# EasyEDA Pro project ProPrj_MiniFoc_AT32F403A.epro, schematic FOC_AT32_FD6288_CAN

## Sheets
1 电源
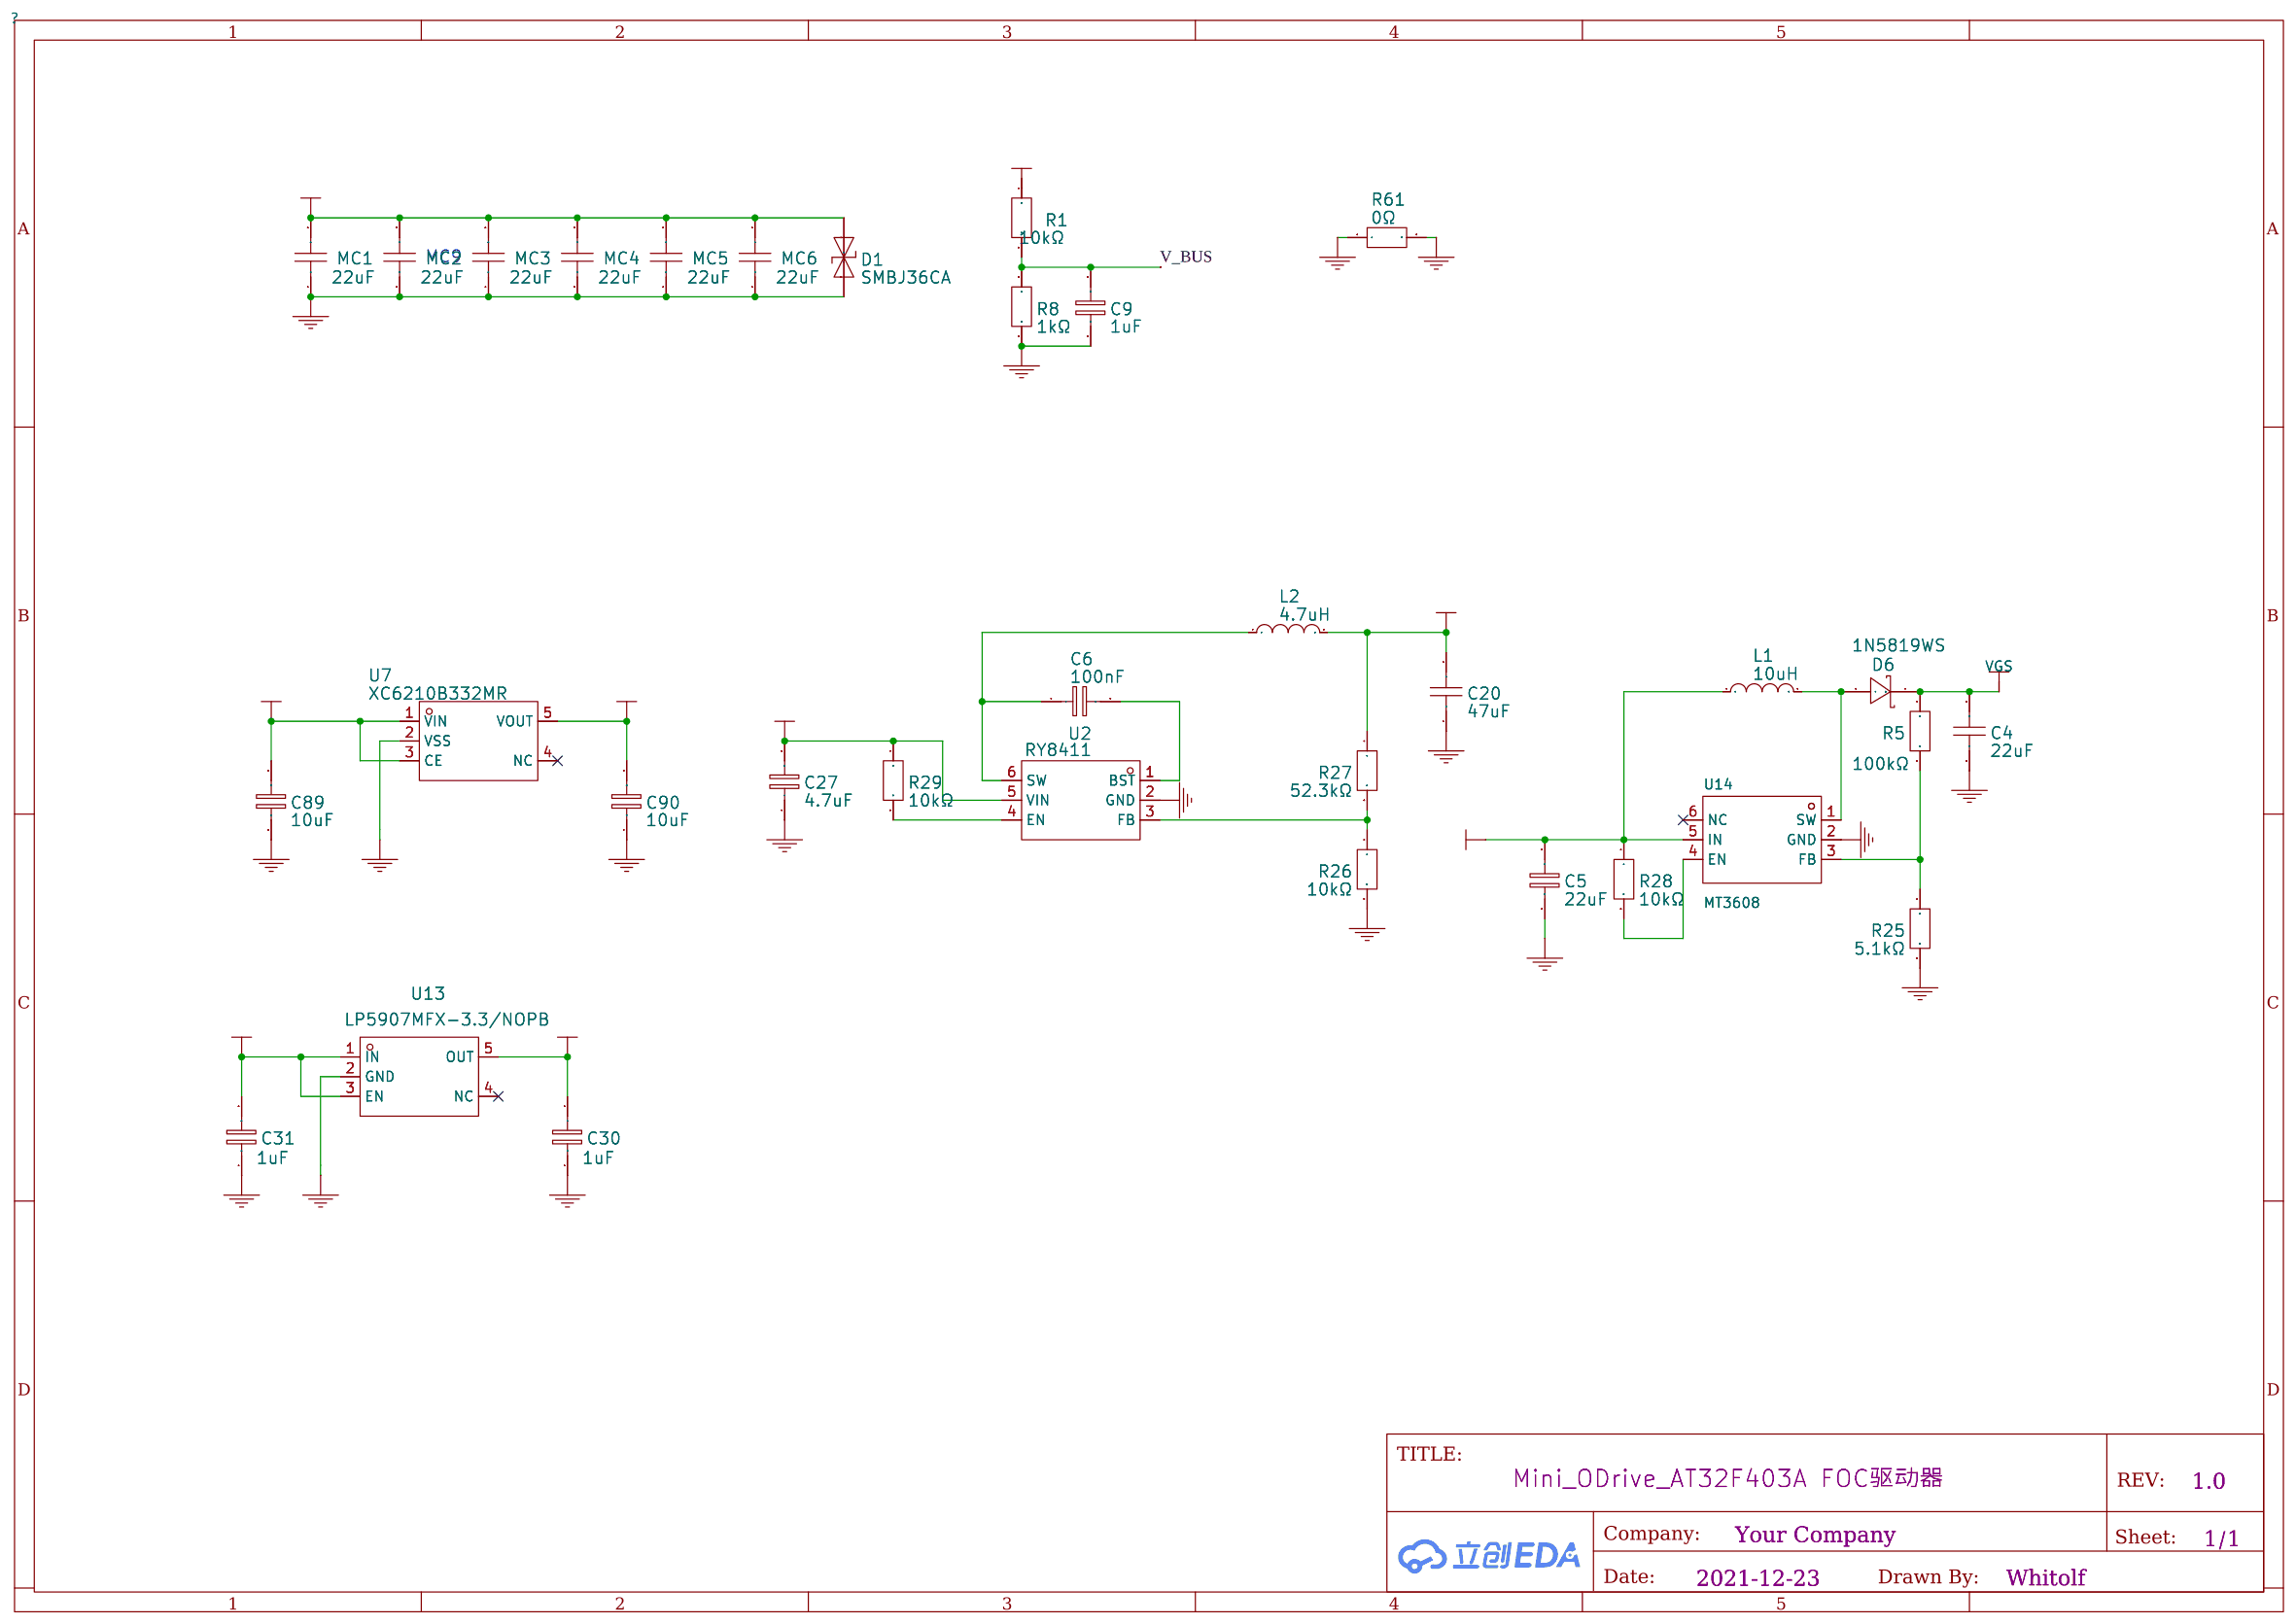
[diagram p0: 电源]
2 驱动
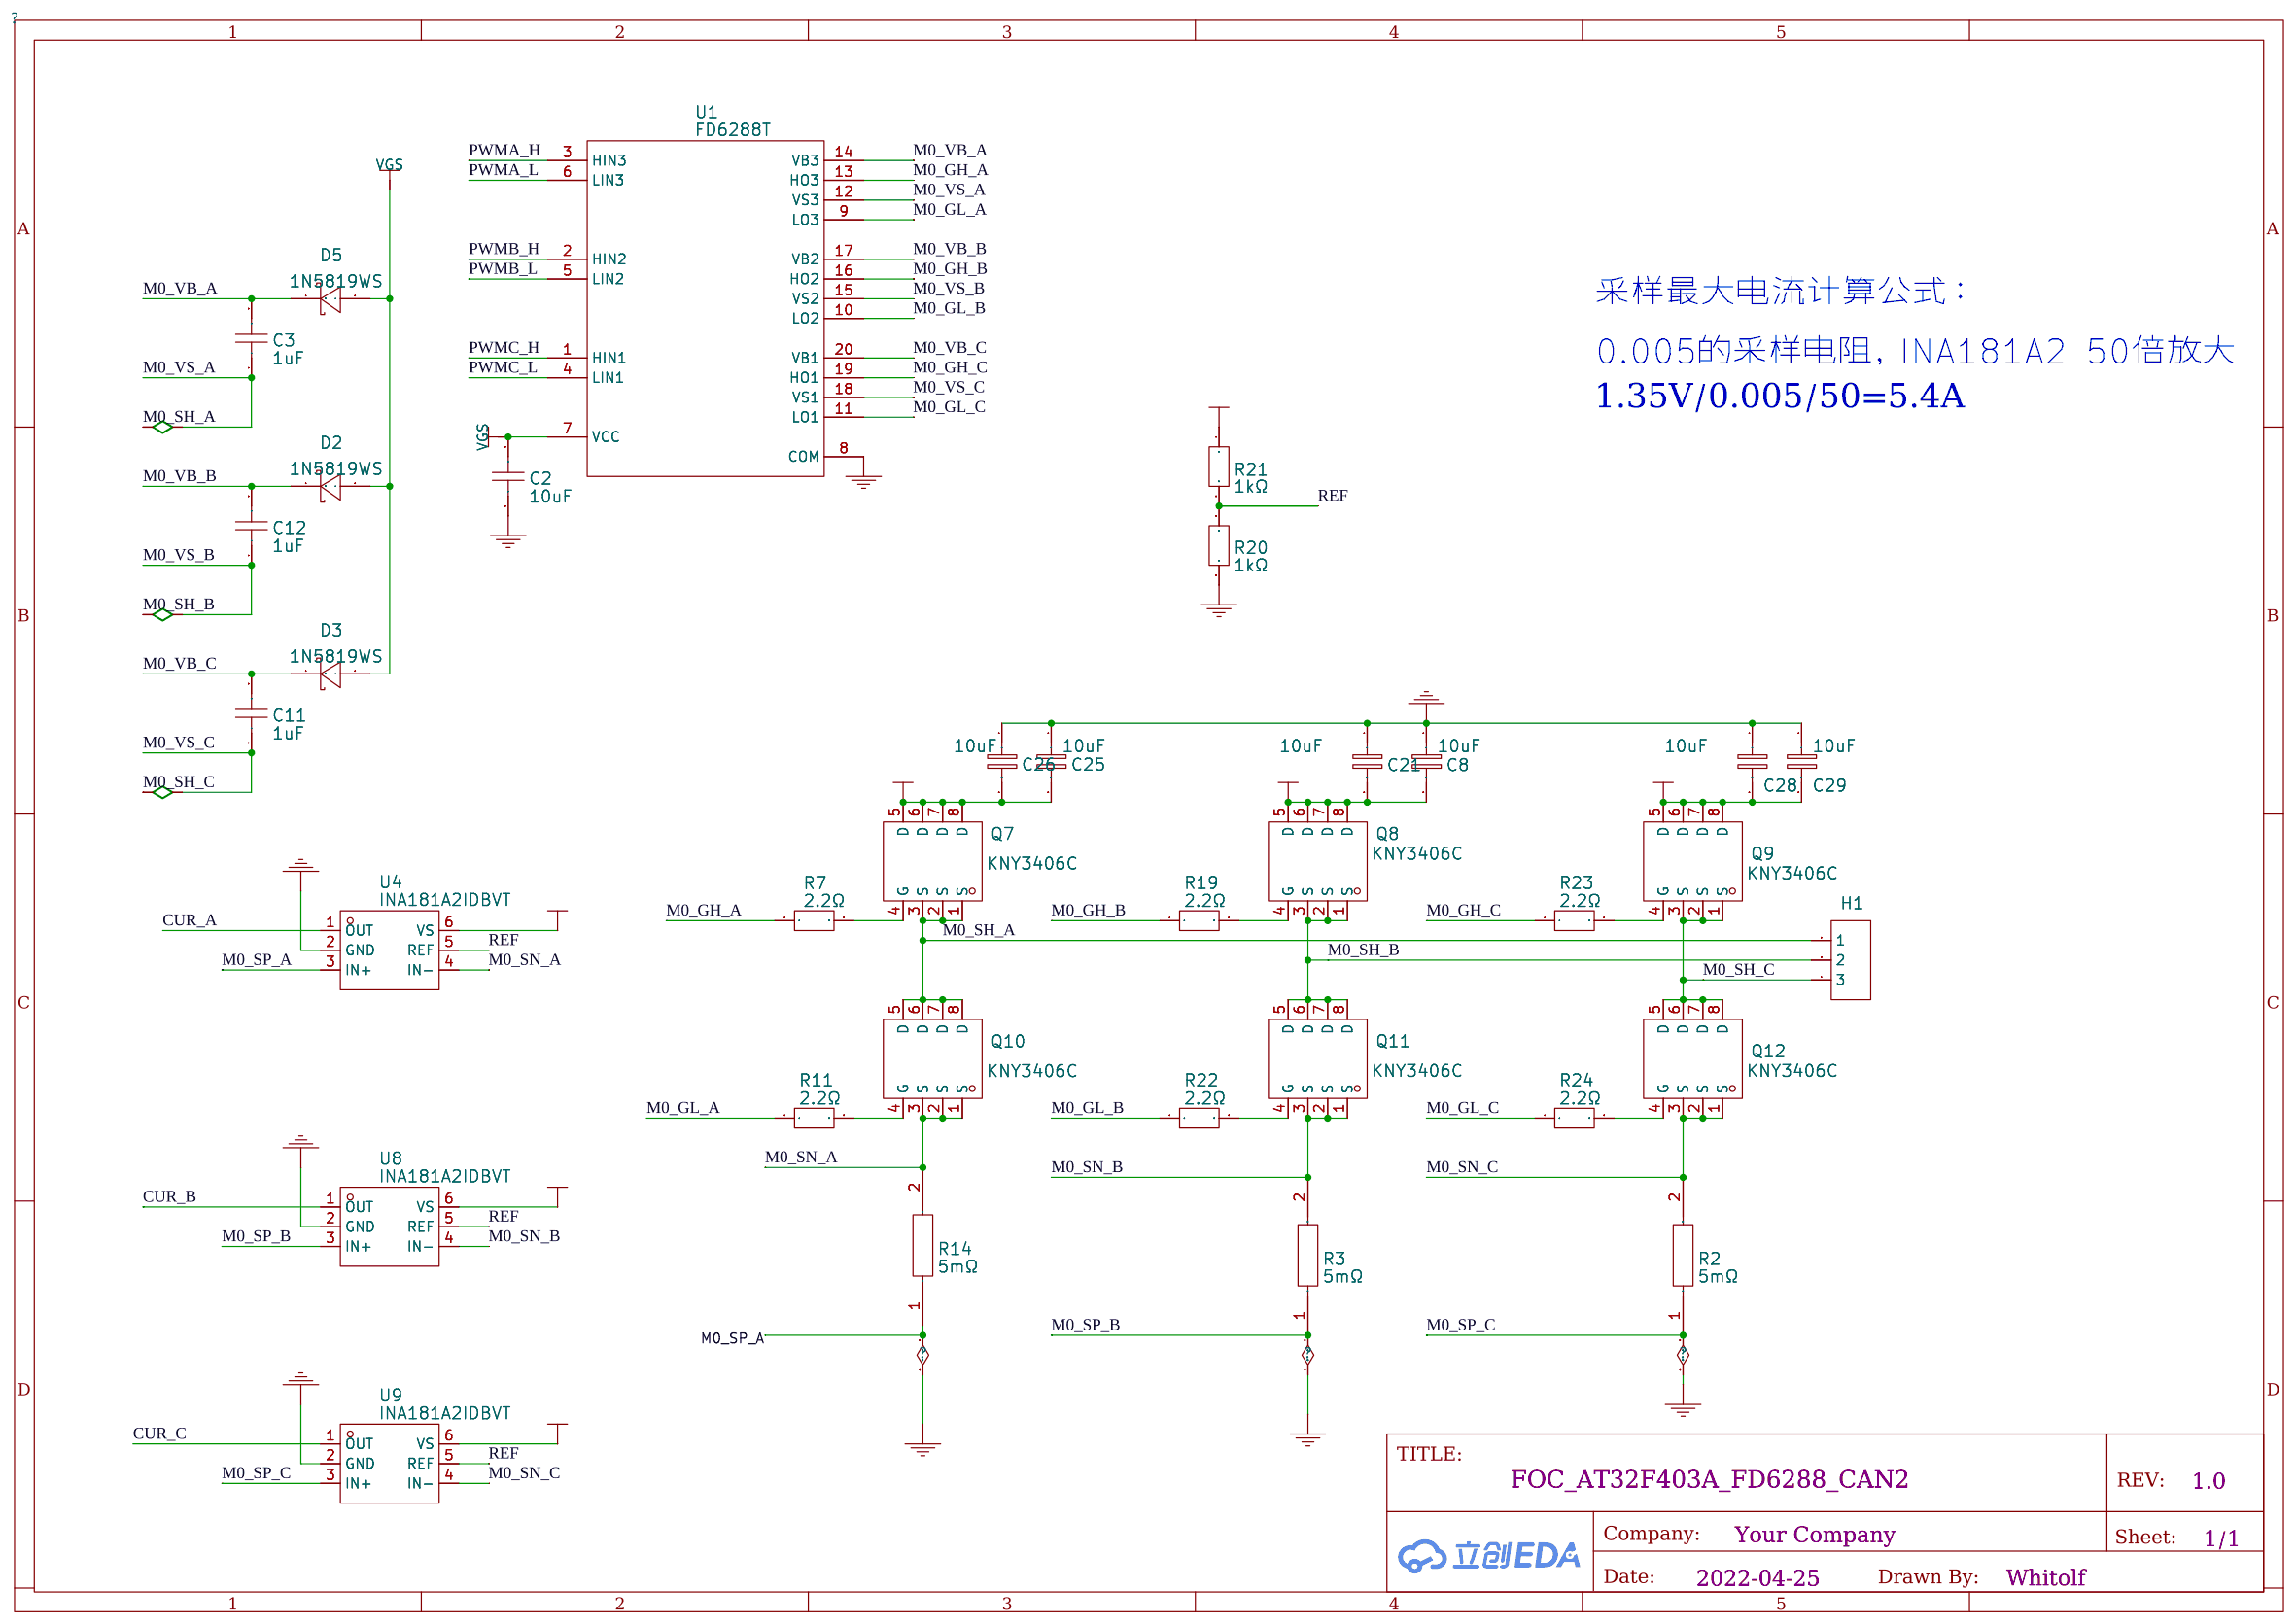
[diagram p1: 驱动]
3 主控和接口
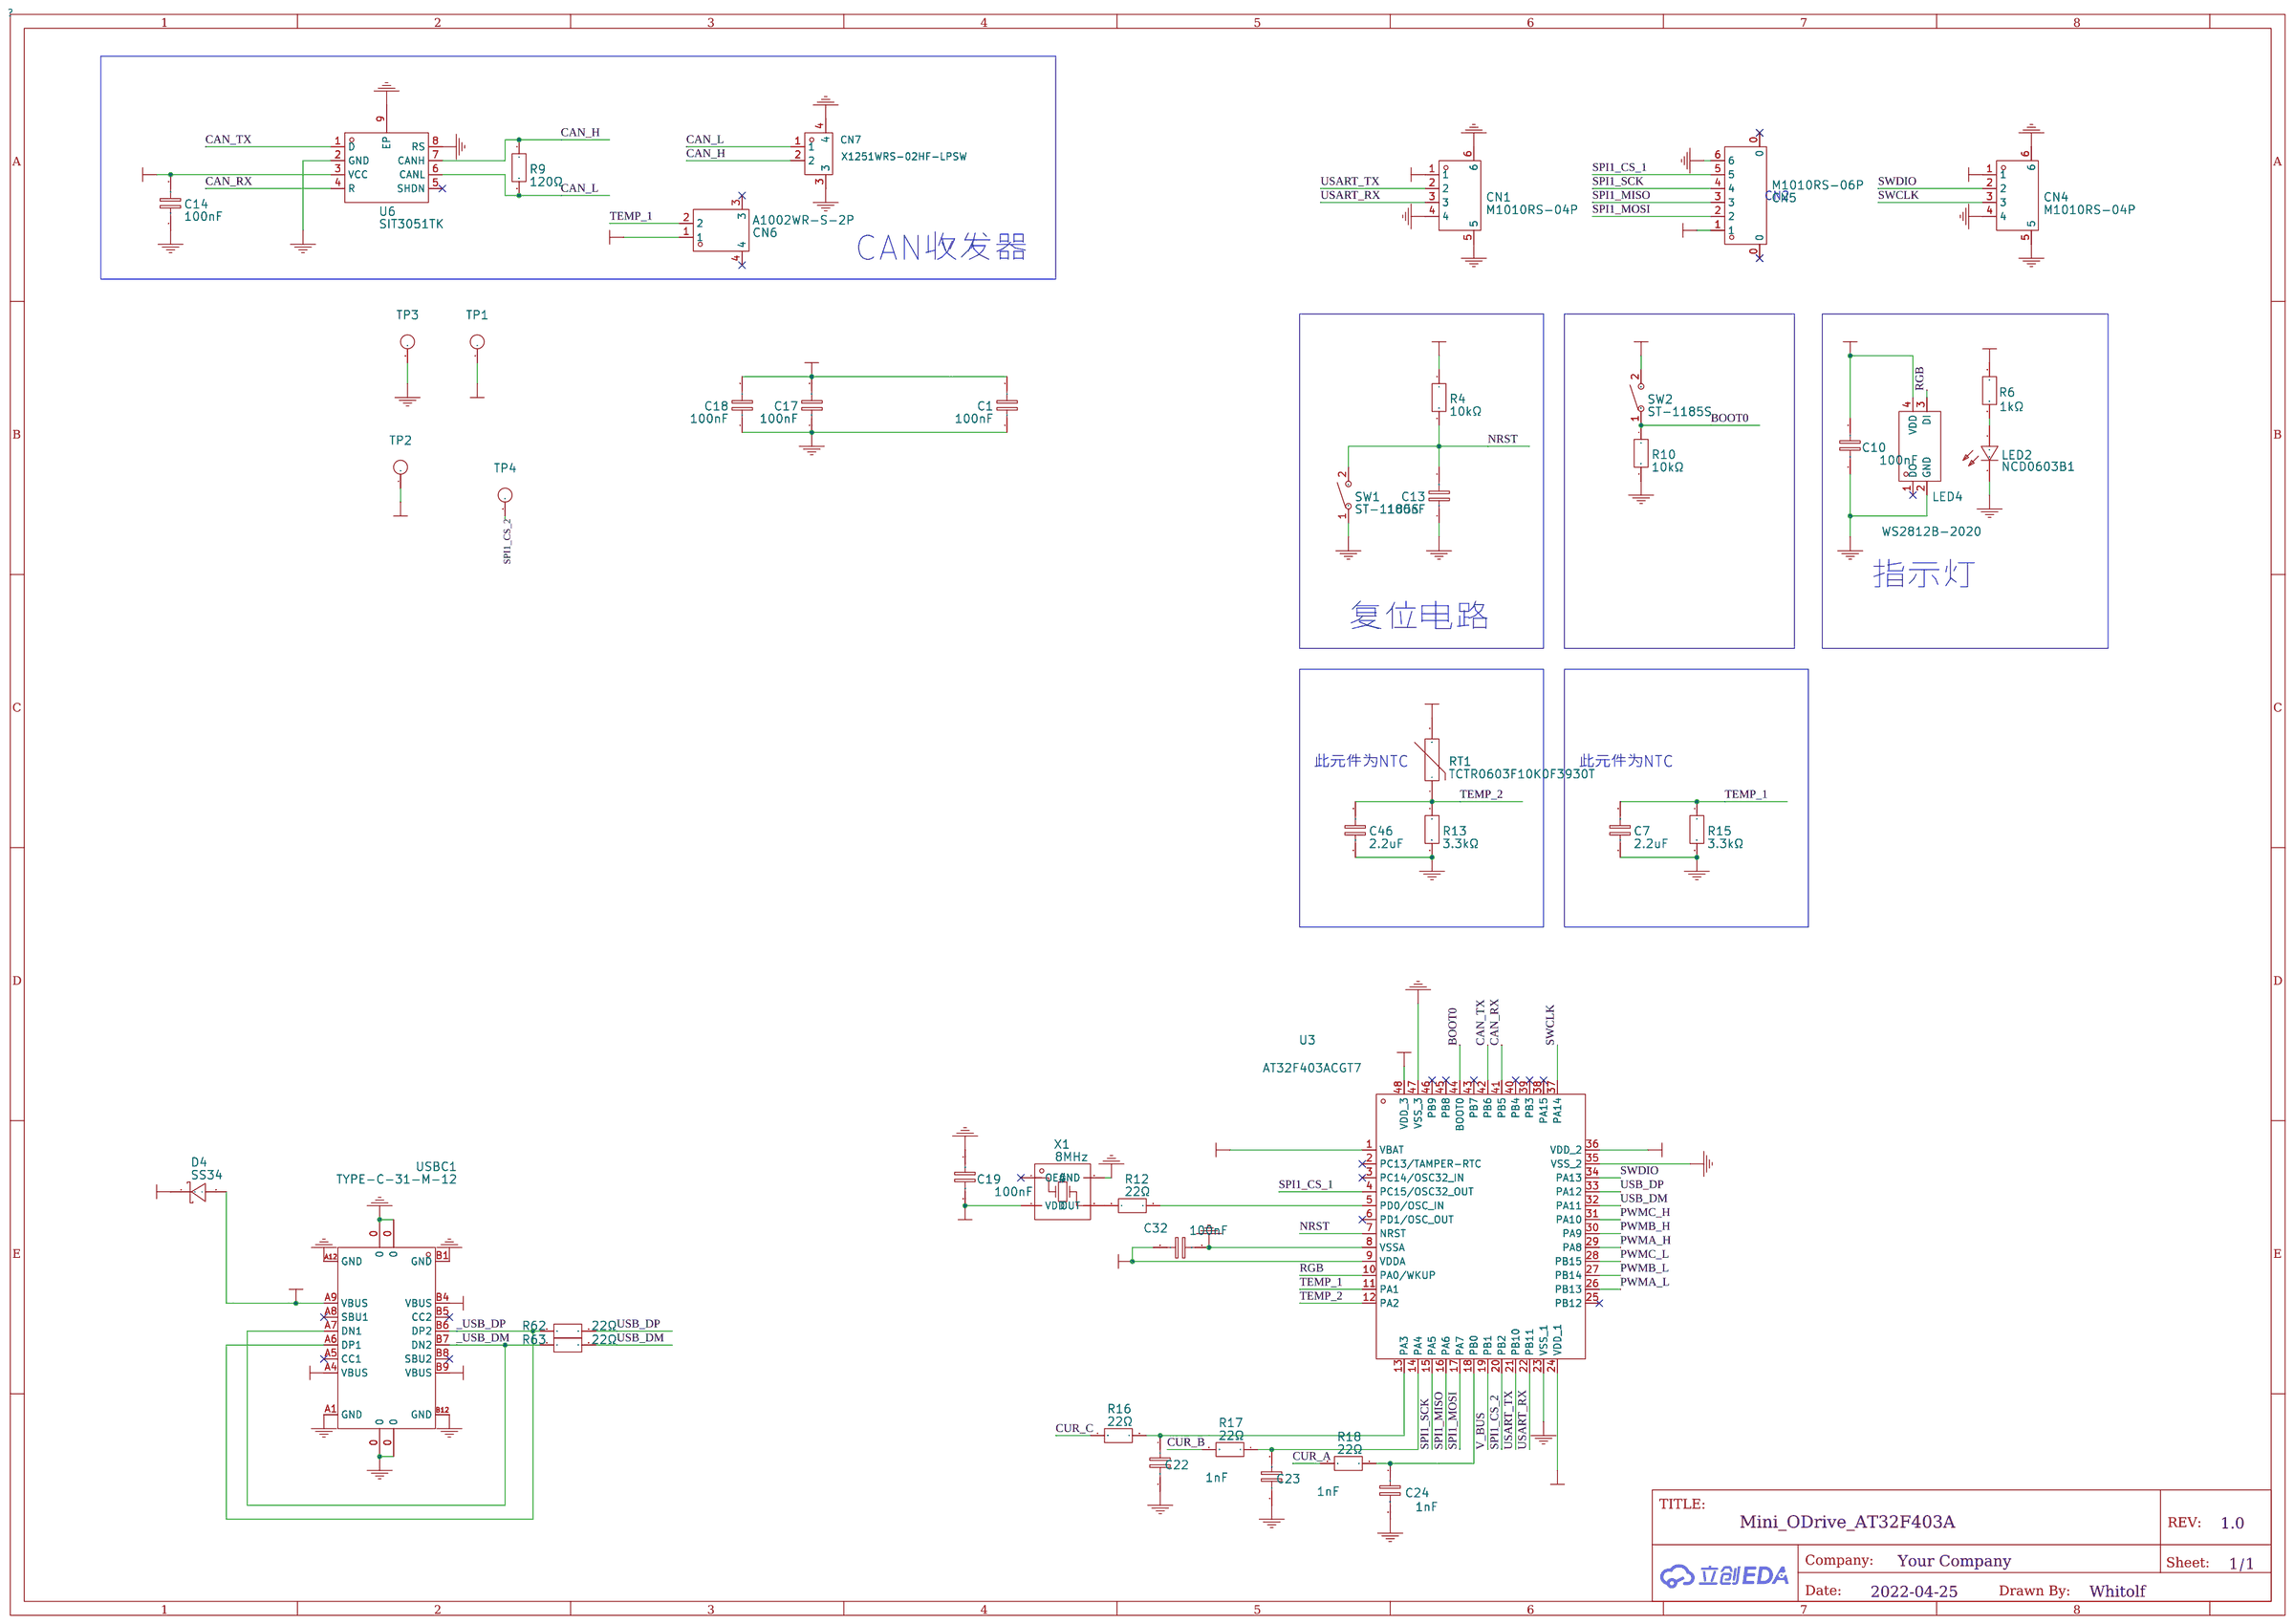
[diagram p2: 主控和接口]

## Parts
sheet 主控和接口
C1  100nF  [C0603_SMALL]
C7  2.2uF  [C0603_SMALL]
C10  100nF  [C0603_SMALL]
C13  100nF  [C0603_SMALL]
C14  100nF  [C0603_SMALL]
C17  100nF  [C0603_SMALL]
C18  100nF  [C0603_SMALL]
C19  100nF  [C0603_SMALL]
C22  1nF  [C0603_SMALL]
C23  1nF  [C0603_SMALL]
C24  1nF  [C0603_SMALL]
C32  100nF  [C0603_SMALL]
C46  2.2uF  [C0603_SMALL]
CN1  M1010RS-04P  [CONN-SMD_M1010RS-04P]
CN4  M1010RS-04P  [CONN-SMD_M1010RS-04P]
CN5  M1010RS-06P  [CONN-SMD_M1010RS-06P]
CN6  A1002WR-S-2P  [CONN-SMD_A1002WR-S-2P]
CN7  X1251WRS-02HF-LPSW  [CONN-SMD_2P-P1.25_X1251WRS-02HF-LPSW]
D4  SS34  [SMA_L4.4-W2.8-LS5.4-RD]
LED2  NCD0603B1  [LED0603_RED_SMALL]
LED4  WS2812B-2020  [LED-SMD_4P-L2.0-W2.0-TL_WS2812B-2020]
R4  10kΩ  [R0603_SMALL]
R6  1kΩ  [R0603_SMALL]
R9  120Ω  [R0603_SMALL]
R10  10kΩ  [R0603_SMALL]
R12  22Ω  [R0603_SMALL]
R13  3.3kΩ  [R0603_SMALL]
R15  3.3kΩ  [R0603_SMALL]
R16  22Ω  [R0603_SMALL]
R17  22Ω  [R0603_SMALL]
R18  22Ω  [R0603_SMALL]
R62  22Ω  [R0603_SMALL]
R63  22Ω  [R0603_SMALL]
RT1  TCTR0603F10K0F3930T  [R0603_SMALL]
SW1  ST-1185S  [SW-SMD_ST-1185S]
SW2  ST-1185S  [SW-SMD_ST-1185S]
TP1  Testpoint 1.6mm  [TESTPOINT 1.6MM]  (no BOM)
TP2  Testpoint 1.6mm  [TESTPOINT 1.6MM]  (no BOM)
TP3  Testpoint 1.6mm  [TESTPOINT 1.6MM]  (no BOM)
TP4  Testpoint 1.6mm  [TESTPOINT 1.6MM]  (no BOM)
U3  AT32F403ACGT7  [LQFP-48_L7.0-W7.0-P0.50-LS9.0-BL]
U6  SIT3051TK  [DFN-8_L3.0-W3.0-P0.65-BL-EP]
USBC1  TYPE-C-31-M-12  [USB-C_SMD-TYPE-C-31-M-12]
X1  8MHz  [OSC-SMD_4P-L2.5-W2.0-BL_DSB321SDA]
sheet 电源
C4  22uF  [C1206_SMALL]
C5  22uF  [C1206_SMALL]
C6  100nF  [C0603_SMALL]
C9  1uF  [C0603_SMALL]
C20  47uF  [C1206_SMALL]
C27  4.7uF  [C1206_SMALL]
C30  1uF  [C0603_SMALL]
C31  1uF  [C0603_SMALL]
C89  10uF  [C0603_SMALL]
C90  10uF  [C0603_SMALL]
D1  SMBJ36CA  [SMB(DO-214AA)]
D6  1N5819WS  [SOD-323_L1.8-W1.3-LS2.5-RD]
L1  10uH  [IND-SMD_L2.5-W2.0]
L2  4.7uH  [IND-SMD_L2.5-W2.0]
MC1  22uF  [C1210]
MC2  22uF  [C1210]
MC3  22uF  [C1210]
MC4  22uF  [C1210]
MC5  22uF  [C1210]
MC6  22uF  [C1210]
R1  10kΩ  [R0603_SMALL]
R5  100kΩ  [R0603_SMALL]
R8  1kΩ  [R0603_SMALL]
R25  5.1kΩ  [R0603_SMALL]
R26  10kΩ  [R0603_SMALL]
R27  52.3kΩ  [R0603_SMALL]
R28  10kΩ  [R0603_SMALL]
R29  10kΩ  [R0603_SMALL]
R61  0Ω  [R0603_SMALL]
U2  RY8411  [SOT-23-6_L2.9-W1.6-P0.95-LS2.8-BR]
U7  XC6210B332MR  [SOT-25_L3.0-W1.6-P0.95-LS2.8-BL]
U13  LP5907MFX-3.3/NOPB  [SOT-23-5_L3.0-W1.7-P0.95-LS2.8-BR]
U14  MT3608  [SOT-23-6_L2.9-W1.6-P0.95-LS2.8-BR]
sheet 驱动
C2  10uF  [C0603_SMALL]
C3  1uF  [C0603_SMALL]
C8  10uF  [C1206_SMALL]
C11  1uF  [C0603_SMALL]
C12  1uF  [C0603_SMALL]
C21  10uF  [C1206_SMALL]
C25  10uF  [C1206_SMALL]
C26  10uF  [C1206_SMALL]
C28  10uF  [C1206_SMALL]
C29  10uF  [C1206_SMALL]
D2  1N5819WS  [SOD-323_L1.8-W1.3-LS2.5-RD]
D3  1N5819WS  [SOD-323_L1.8-W1.3-LS2.5-RD]
D5  1N5819WS  [SOD-323_L1.8-W1.3-LS2.5-RD]
H1  MR30-M  [MR30-M]
Q7  KNY3406C  [PDFNWB-8L_L6.0-W5.0-P1.27-BL-EP_CON]
Q8  KNY3406C  [PDFNWB-8L_L6.0-W5.0-P1.27-BL-EP_CON]
Q9  KNY3406C  [PDFNWB-8L_L6.0-W5.0-P1.27-BL-EP_CON]
Q10  KNY3406C  [PDFNWB-8L_L6.0-W5.0-P1.27-BL-EP_CON]
Q11  KNY3406C  [PDFNWB-8L_L6.0-W5.0-P1.27-BL-EP_CON]
Q12  KNY3406C  [PDFNWB-8L_L6.0-W5.0-P1.27-BL-EP_CON]
R2  5mΩ  [R2512]
R3  5mΩ  [R2512]
R7  2.2Ω  [R0603_SMALL]
R11  2.2Ω  [R0603_SMALL]
R14  5mΩ  [R2512]
R19  2.2Ω  [R0603_SMALL]
R20  1kΩ  [R0603_SMALL]
R21  1kΩ  [R0603_SMALL]
R22  2.2Ω  [R0603_SMALL]
R23  2.2Ω  [R0603_SMALL]
R24  2.2Ω  [R0603_SMALL]
U1  FD6288T  [TSSOP-20_L6.5-W4.4-P0.65-LS6.4-BL]
U4  INA181A2IDBVT  [SOT-23-6_L2.9-W1.6-P0.95-LS2.8-BR]
U8  INA181A2IDBVT  [SOT-23-6_L2.9-W1.6-P0.95-LS2.8-BR]
U9  INA181A2IDBVT  [SOT-23-6_L2.9-W1.6-P0.95-LS2.8-BR]

## Library data of the parts
C1 C6 C10 C13 C14 C17-C19 C32 = CC0603KRX7R9BB104: 容值:100nF;精度:±10%;额定电压:50V;材质(温度系数):X7R;; LCSC Part Name: 100nF ±10% 50V; Supplier Part: C14663; Manufacturer: YAGEO(国巨); Supplier Footprint: 0603; JLCPCB Part Class: Basic Part; Datasheet: https://atta.szlcsc.com/upload/public/pdf/source/20180910/C282072_33301C7F631E79921B82A8DAC6BCC5B3.pdf; Supplier: LCSC; Tolerance: ±10%; Voltage Rated: 50V; Temperature Coefficient: X7R; Check: true
C7 C46 = CC0603KRX7R7BB225: 容值:2.2uF;精度:±10%;额定电压:16V;材质(温度系数):X7R;; LCSC Part Name: 2.2uF ±10% 16V; Supplier Part: C914769; Manufacturer: YAGEO(国巨); Supplier Footprint: 0603; JLCPCB Part Class: Extended Part; Datasheet: https://atta.szlcsc.com/upload/public/pdf/source/20201217/C914769_172E140EC7E52AC241E5EC40E74BC1D4.pdf; Supplier: LCSC; Tolerance: ±10%; Voltage Rated: 16V; Temperature Coefficient: X7R; Check: true
C22-C24 = 0603B102J500NT: 容值:1nF;精度:±5%;额定电压:50V;材质(温度系数):X7R;; LCSC Part Name: 1nF ±5% 50V; Supplier Part: C8808; Manufacturer: FH(风华); Supplier Footprint: 0603; JLCPCB Part Class: Extended Part; Datasheet: https://atta.szlcsc.com/upload/public/pdf/source/20170923/C8808_1506149551246988954.pdf; Supplier: LCSC; Tolerance: ±5%; Voltage Rated: 50V; Temperature Coefficient: X7R; Check: true
CN1 CN4 = M1010RS-04P: 参考系列:-;间距:1mm;插针结构:1x4P;排数:1;每排PIN数:4;行距:-;公母:公型插针;安装方式:卧贴;额定电流:1A;工作温度范围:-25℃~+85℃;; LCSC Part Name: 针座 SH 间距1.0mm 4P 卧式贴片 SH; Supplier Part: C541846; Manufacturer: XFCN(台湾兴飞); Supplier Footprint: SMD,P=1mm; JLCPCB Part Class: Extended Part; Datasheet: https://atta.szlcsc.com/upload/public/pdf/source/20200518/C541847_4FBBB7CE1CCFE042AF6DD43CBAA42E89.pdf; Supplier: LCSC; Pitch: 1mm; Pins Structure: 1x4P; Number of Rows: 1; Number of PINs Per Row: 4; Gender: 公型插针; Mounting Style: 卧贴; Current Rating (Max): 1A; Operating Temperature Range: -25℃~+85℃
CN5 = M1010RS-06P: 参考系列:-;间距:1mm;插针结构:1x6P;排数:1;每排PIN数:6;行距:-;公母:公型插针;安装方式:卧贴;额定电流:1A;工作温度范围:-25℃~+85℃;; LCSC Part Name: 针座 SH 间距1.0mm 6P 卧式贴片 SH; Supplier Part: C541848; Manufacturer: XFCN(台湾兴飞); Supplier Footprint: SMD,P=1mm; JLCPCB Part Class: Extended Part; Datasheet: https://atta.szlcsc.com/upload/public/pdf/source/20200518/C541847_4FBBB7CE1CCFE042AF6DD43CBAA42E89.pdf; Supplier: LCSC; Pitch: 1mm; Pins Structure: 1x6P; Number of Rows: 1; Number of PINs Per Row: 6; Gender: 公型插针; Mounting Style: 卧贴; Current Rating (Max): 1A; Operating Temperature Range: -25℃~+85℃
CN6 = A1002WR-S-2P: 系列:SH;连接器类型:接头;触头类型:公形引脚;间距:0.039"(1.00mm);针脚数:2;; LCSC Part Name: 2P,脚距1mm; Supplier Part: C239520; Manufacturer: CJT(长江连接器); Supplier Footprint: SMD,P=1mm; JLCPCB Part Class: Extended Part; Datasheet: https://atta.szlcsc.com/upload/public/pdf/watermark/20190926/C239520_20E9BDF14633EA92CE6C693DF62606DD.pdf; Supplier: LCSC; Series: SH; Connector Type: 接头; Contact Type: 公形引脚; Pitch: 0.039"(1.00mm); Number of Positions: 2; Number of Rows: 1; Mounting Type: 表面贴装，直角; Contact Material: 磷青铜
CN7 = X1251WRS-02HF-LPSW: 参考系列:GH;间距:1.25mm;插针结构:1x2P;排数:1;每排PIN数:2;行距:-;公母:母型插口;安装方式:卧贴;额定电流:1A;触头材质:磷青铜;触头镀层:锡;工作温度范围:-40℃~+110℃;焊接温度(最大值):260℃;; LCSC Part Name: GH 1.25mm 1x2P 卧贴 GH; Supplier Part: C388707; Manufacturer: XKB Connectivity(中国星坤); Supplier Footprint: SMD,P=1.25mm; JLCPCB Part Class: Extended Part; Datasheet: https://atta.szlcsc.com/upload/public/pdf/source/20211011/E2F7306AE87519079AD4EC816349A567.pdf; Supplier: LCSC; Reference Series: GH; Pitch: 1.25mm; Pins Structure: 1x2P; Number of Rows: 1; Number of PINs Per Row: 2; Gender: 母型插口; Mounting Style: 卧贴; Current Rating (Max): 1A; Contact Material: 磷青铜; Contact Plating: 锡; Operating Temperature Range: -40℃~+110℃; Welding Temperature (Max): 260℃
D4 = SS34_C8678: 二极管配置:独立式;直流反向耐压(Vr):40V;平均整流电流(Io):3A;正向压降(Vf):550mV@3A;反向电流(Ir):500uA@40V;; LCSC Part Name: 40V 3A 550mV@3A; Supplier Part: C8678; Manufacturer: MDD; Supplier Footprint: SMA(DO-214AC); JLCPCB Part Class: Basic Part; Datasheet: https://atta.szlcsc.com/upload/public/pdf/source/20220408/D0396E57A6E83C6AFC0ED25EC9EDE030.pdf; Supplier: LCSC; Diode Configuration: 独立式; Reverse Voltage (Vr): 40V; Average Rectified Current (Io): 3A; Forward Voltage (Vf@If): 550mV@3A; Reverse Leakage Current (Ir): 500uA@40V
LED2 = NCD0603B1: 发光颜色:蓝灯;; LCSC Part Name: 蓝灯; Supplier Part: C84266; Manufacturer: 国星光电; Supplier Footprint: 0603; JLCPCB Part Class: Extended Part; Datasheet: https://atta.szlcsc.com/upload/public/pdf/source/20200820/C84266_6A3CDBEFA72C6CAD68EDA53474ADAE6C.pdf; Supplier: LCSC; Emitted Color: 蓝灯
LED4 = WS2812B-2020: 发光颜色:RGB三色;二极管配置:-;透镜颜色:-;主波长:470.4nm；622.5nm；515.6nm;峰值波长:-;色温:-;测试电流:12mA;功率:-;发光角度:-;安装方式:-;工作温度:-;; LCSC Part Name: RGB三色 470.4nm 515.6nm 622.5nm （注意防潮，请查阅规格书中对应具体内容）; Supplier Part: C965555; Manufacturer: worldsemi; Supplier Footprint: SMD,2x2mm; JLCPCB Part Class: Extended Part; Datasheet: https://atta.szlcsc.com/upload/public/pdf/source/20201203/C965555_5C919C4B6231E6ADE06011FB0D94282B.pdf; Supplier: LCSC; Emitted Color: RGB三色; Dominant Wavelength: 470.4nm；622.5nm；515.6nm; Forward Current: 12mA
R1 R4 R10 R25 R26 R28 R29 = CR0603JA0103G: 电阻类型:厚膜电阻;阻值:10kΩ;精度:±5%;功率:100mW;温度系数:±200ppm/℃;最大工作电压:50V;工作温度范围:-55℃~+125℃;; LCSC Part Name: 10kΩ ±5% 100mW; Supplier Part: C101254; Manufacturer: LIZ(丽智电子); Supplier Footprint: 0603; JLCPCB Part Class: Extended Part; Datasheet: https://atta.szlcsc.com/upload/public/pdf/source/20170408/1491631441449.pdf; Supplier: LCSC; Type: 厚膜电阻; Tolerance: ±5%; Power(Watts): 100mW; Temperature Coefficient: ±200ppm/℃; Overload Voltage (Max): 50V; Operating Temperature Range: -55℃~+125℃; Check: true
R6 R8 R20 R21 = SCR0603J1K: 阻值:1kΩ;精度:±5%;; LCSC Part Name: 1kΩ ±5%; Supplier Part: C3017736; Manufacturer: VO(翔胜); Supplier Footprint: 0603; JLCPCB Part Class: Extended Part; Datasheet: https://atta.szlcsc.com/upload/public/pdf/source/20220513/247AF9639BA21CF93567DC289CCC6A22.pdf; Supplier: LCSC; Tolerance: ±5%; Check: true
R9 = RC0603FR-07120RL: 阻值:120Ω;精度:±1%;功率:100mW;温度系数:±100ppm/℃;最大工作电压:75V;工作温度范围:-55℃~+155℃;; LCSC Part Name: 120Ω ±1% 100mW; Supplier Part: C114640; Manufacturer: YAGEO(国巨); Supplier Footprint: 0603; JLCPCB Part Class: Extended Part; Datasheet: https://atta.szlcsc.com/upload/public/pdf/source/20170818/C114640_1503051151018895125.pdf; Supplier: LCSC; Tolerance: ±1%; Power(Watts): 100mW; Temperature Coefficient: ±100ppm/℃; Overload Voltage (Max): 75V; Operating Temperature Range: -55℃~+155℃; Check: true
R12 R16-R18 R62 R63 = CR0603J22R0P05Z: 阻值:22Ω;精度:±5%;功率:100mW;温度系数:±100ppm/℃;; LCSC Part Name: 22Ω ±5% 100mW; Supplier Part: C881386; Manufacturer: EVER OHMS(天二科技); Supplier Footprint: 0603; JLCPCB Part Class: Extended Part; Datasheet: https://atta.szlcsc.com/upload/public/pdf/source/20201014/C881429_ABC29D63C8D6A11EB63D87348B25AA7B.pdf; Supplier: LCSC; Tolerance: ±5%; Power(Watts): 100mW; Temperature Coefficient: ±100ppm/℃; Check: true
R13 R15 = CR0603F3K30P05Z: 阻值:3.3kΩ;精度:±1%;功率:100mW;温度系数:±100ppm/℃;; LCSC Part Name: 3.3kΩ ±1% 100mW; Supplier Part: C880995; Manufacturer: EVER OHMS(天二科技); Supplier Footprint: 0603; JLCPCB Part Class: Extended Part; Datasheet: https://atta.szlcsc.com/upload/public/pdf/source/20201014/C881429_ABC29D63C8D6A11EB63D87348B25AA7B.pdf; Supplier: LCSC; Tolerance: ±1%; Power(Watts): 100mW; Temperature Coefficient: ±100ppm/℃; Check: true
RT1 = TCTR0603F10K0F3930T: 阻值(25℃):10kΩ;电阻精度:±1%;B值精度:±1%;B值(25℃/50℃):3930K;功率:120mW;最大稳态电流(25℃):-;B值(25℃/75℃):-;B值(25℃/85℃):-;B值(25℃/100℃):-;工作温度:-40℃~+125℃;; LCSC Part Name: 10kΩ 电阻精度:±1% 3930K; Supplier Part: C525383; Manufacturer: RESI(开步睿思）; Supplier Footprint: 0603; JLCPCB Part Class: Extended Part; Datasheet: https://atta.szlcsc.com/upload/public/pdf/source/20200506/C525364_82DA399420FD8342B6C8F2E2EC87328D.pdf; Supplier: LCSC; Resistance @ 25℃: 10kΩ; Resistance Tolerance: ±1%; B Constant Tolerance: ±1%; B Constant (25℃/50℃): 3930K; Power: 120mW; Operating Temperature: -40℃~+125℃; Check: true
SW1 SW2 = ST-1185S: 触点电流:50mA;额定电压(DC):12V;绝缘电阻:100MΩ;电路结构:单刀单掷;安装方式:立贴;按钮形状:圆形按钮;按钮/盖帽颜色:黑色;机械寿命:100000;工作温度:-20℃~+70℃;引脚样式:SMD接片;开关长度:4mm;开关宽度:3mm;开关高度:2mm;带支架:否;; LCSC Part Name: 轻触开关正按小龟; Supplier Part: C589191; Manufacturer: RISHENG(日昇); Supplier Footprint: SMD; JLCPCB Part Class: Extended Part; Datasheet: https://atta.szlcsc.com/upload/public/pdf/source/20200922/C589191_E74F821EA1C61BCC16EBC99CF1D66EDD.pdf; Supplier: LCSC; Contact Current: 50mA; Voltage Rating (DC): 12V; Insulation Resistance: 100MΩ; Circuit: 单刀单掷; Mounting Style: 立贴; Actuator Style: 圆形按钮; Actuator/Cap Color: 黑色; Mechanical Life: 100000; Operating Temperature: -20℃~+70℃; Pin Style: SMD接片; Switch Length: 4mm; Switch Width: 3mm; Switch Height: 2mm; Strike Gundam: 否
TP1-TP4 = Testpoint 1.6mm: Check: true
U3 = AT32F403ACGT7: 频率 (MHz)：240，FLASH (KB)：1024，SRAM (KB)：224，CPU：ARM? Cortex?-M4，工作电压（V）：2.6~3.6，工作温度：-40°C ~ 105°C，封装：LQFP48; Supplier Part: C528437; Manufacturer: ARTERY（雅特力）; Supplier Footprint: LQFP-48; JLCPCB Part Class: Extended Part; Datasheet: https://atta.szlcsc.com/upload/public/pdf/source/20200507/C528435_60E4F7A933572380D38CD1507797F883.pdf; Supplier: LCSC
U6 = SIT3051TK: 类型:-;协议类别:-;驱动器/接收器数:-;数据速率:-;; LCSC Part Name: CAN收发器芯片; Supplier Part: C601078; Manufacturer: SIT(芯力特); Supplier Footprint: DFN3x3-8; JLCPCB Part Class: Extended Part; Datasheet: https://atta.szlcsc.com/upload/public/pdf/source/20200610/C601078_B1F4AB5D187DBA98E917965AB02FEC6C.pdf; Supplier: LCSC
USBC1 = TYPE-C-31-M-12: 连接器类型:Type-C;标准:-;公母:母座;触点数量:16;端口数量:1;安装方式:-;额定电流 - 电源:5A;触头材质:-;触头镀层:-;工作温度范围:-;焊接温度(最大值):-;; LCSC Part Name: Type-C 母座; Supplier Part: C165948; Manufacturer: 韩国韩荣; Supplier Footprint: SMD; JLCPCB Part Class: Extended Part; Datasheet: https://atta.szlcsc.com/upload/public/pdf/source/20220525/466408E853115E789EDB0DDC29077C05.pdf; Supplier: LCSC; Connector Type: Type-C; Gender: 母座; Number of Contacts: 16; Number of Ports: 1; Current Rating - Power (Max): 5A
X1 = 2N08000G33YC: Supplier: LCSC; Supplier Part: C252325; Manufacturer: SHENZHEN CRYSTAL TECH; JLCPCB Part Class: Extended Part
C4 C20 = C1206B476M016T: 容值:47uF;精度:±20%;额定电压:16V;材质(温度系数):-;; LCSC Part Name: 47uF ±20% 16V; Supplier Part: C607993; Manufacturer: IHHEC(禾伸堂); Supplier Footprint: 1206; JLCPCB Part Class: Extended Part; Datasheet: https://atta.szlcsc.com/upload/public/pdf/source/20190313/C374174_331C86E4A68CC9C732DA87186AAF7F8A.pdf; Supplier: LCSC; Tolerance: ±20%; Voltage Rated: 16V; Check: true
C5 C27 = CC1206KKX7R9BB475: 容值:4.7uF;精度:±10%;额定电压:50V;材质(温度系数):X7R;; LCSC Part Name: 4.7uF ±10% 50V; Supplier Part: C132170; Manufacturer: YAGEO(国巨); Supplier Footprint: 1206; JLCPCB Part Class: Extended Part; Datasheet: https://atta.szlcsc.com/upload/public/pdf/source/20170925/C132170_1506321669570990451.pdf; Supplier: LCSC; Tolerance: ±10%; Voltage Rated: 50V; Temperature Coefficient: X7R; Check: true
C3 C9 C11 C12 C30 C31 = CC0603KRX5R8BB105: 容值:1uF;精度:±10%;额定电压:25V;材质(温度系数):X5R;; LCSC Part Name: 1uF ±10% 25V; Supplier Part: C14664; Manufacturer: YAGEO(国巨); Supplier Footprint: 0603; JLCPCB Part Class: Extended Part; Datasheet: https://atta.szlcsc.com/upload/public/pdf/source/20160606/1465200209684.pdf; Supplier: LCSC; Tolerance: ±10%; Voltage Rated: 25V; Temperature Coefficient: X5R; Check: true
C2 C89 C90 = GRM188R6YA106MA73D: 容值:10uF;精度:±20%;额定电压:35V;材质(温度系数):-;; LCSC Part Name: 10uF ±20% 35V; Supplier Part: C194427; Manufacturer: muRata(村田); Supplier Footprint: 0603; JLCPCB Part Class: Extended Part; Datasheet: https://atta.szlcsc.com/upload/public/pdf/source/20210128/C194427_FCA3640823207DDB58700A82F1A19B5F.pdf; Supplier: LCSC; Tolerance: ±20%; Voltage Rated: 35V; Check: true
D1 = SMBJ36CA_C114002: 极性:双向;反向截止电压(Vrwm):36V;击穿电压(最小值):40V;峰值脉冲电流(Ipp)@10/1000μs:10.3A;最大钳位电压:58.1V;; LCSC Part Name: 双向 36V; Supplier Part: C114002; Manufacturer: MDD; JLCPCB Part Class: Extended Part; Datasheet: https://atta.szlcsc.com/upload/public/pdf/source/20180124/C114002_15167561198911295053.pdf; Supplier: LCSC; Polarity: 双向; Reverse Stand-Off Voltage (Vrwm): 36V; Breakdown Voltage (Min): 40V; Peak Pulse Current (Ipp)@10/1000μs: 10.3A; Maximum Clamping Voltage: 58.1V
D2 D3 D5 D6 = 1N5819WS_C191023: 直流反向耐压(Vr):40V;平均整流电流(Io):1A;正向压降(Vf):600mV@1A;; LCSC Part Name: 40V 1A 600mV@1A; Supplier Part: C191023; Manufacturer: Hottech(合科泰); Supplier Footprint: SOD-323; JLCPCB Part Class: Basic Part; Datasheet: https://atta.szlcsc.com/upload/public/pdf/source/20220428/3CB86FD8D28D653594B4E35F9D5AEFD9.pdf; Supplier: LCSC; Reverse Voltage (Vr): 40V; Average Rectified Current (Io): 1A; Forward Voltage (Vf@If): 600mV@1A
L1 L2 = SWPA252012S4R7MT: 电感值:4.7uH;精度:±20%;额定电流:840mA;直流电阻(DCR):377mΩ;; LCSC Part Name: 4.7uH ±20% 840mA 377mΩ; Supplier Part: C87640; Manufacturer: Sunlord(顺络); Supplier Footprint: SMD; JLCPCB Part Class: Extended Part; Datasheet: https://atta.szlcsc.com/upload/public/pdf/source/20210916/AC798BA7E846B7D0B6818F45CD84DB0B.pdf; Supplier: LCSC; Tolerance: ±20%; Rated Current: 840mA; DC Resistance (DCR): 377mΩ
MC1-MC6 = TCC1210X5R107M6R3MT: Supplier: LCSC; Supplier Part: C380369; Manufacturer: CCTC; Check: true
R5 R27 = RMC 0603 52K3 F N: 阻值:52.3kΩ;精度:±1%;功率:100mW;; LCSC Part Name: 52.3kΩ ±1% 100mW; Supplier Part: C325624; Manufacturer: Tyohm(幸亚电阻); Supplier Footprint: 0603; JLCPCB Part Class: Extended Part; Datasheet: https://atta.szlcsc.com/upload/public/pdf/source/20190115/C325624_C83DA14843559B976A7F252575C1556F.pdf; Supplier: LCSC; Tolerance: ±1%; Power(Watts): 100mW; Check: true
R61 = CR0603F0R00P05Z: 阻值:0Ω;精度:±1%;功率:100mW;; LCSC Part Name: 0Ω ±1% 100mW; Supplier Part: C881308; Manufacturer: EVER OHMS(天二科技); Supplier Footprint: 0603; JLCPCB Part Class: Extended Part; Datasheet: https://atta.szlcsc.com/upload/public/pdf/source/20201014/C881429_ABC29D63C8D6A11EB63D87348B25AA7B.pdf; Supplier: LCSC; Tolerance: ±1%; Power(Watts): 100mW; Type: 厚膜电阻; Overload Voltage (Max): 75V; Operating Temperature Range: -55℃~+155℃; Check: true
U2 = RY8411_C2935411: Supplier Part: C2935411; Manufacturer: RYCHiP(蕊源); Supplier Footprint: SOT23-6; JLCPCB Part Class: Extended Part; Datasheet: https://atta.szlcsc.com/upload/public/pdf/source/20211220/DB2E518D79CF9F576C855DA4549CDE87.pdf; Supplier: LCSC
U7 = XC6210B332MR_C424705: 输出类型:固定;输出极性:正;输出通道数:1;最大输入电压:6V;输出电压:3.3V;压差:75mV@(100mA);输出电流:900mA;电源纹波抑制比(PRSS):60dB@(1kHz);; LCSC Part Name: Vin=6V Vout=3.3V 900mA 60dB@(1kHz); Supplier Part: C424705; Manufacturer: TOREX(特瑞仕); Supplier Footprint: SOT-25; JLCPCB Part Class: Extended Part; Datasheet: https://atta.szlcsc.com/upload/public/pdf/source/20190903/C424705_1DFB2113A9A78D399905DBF688657204.pdf; Supplier: LCSC; Output Type: 固定; Output Polarity: 正; Number of Outputs: 1; Maximum Input Voltage: 6V; Output Voltage: 3.3V; Dropout Voltage: 75mV@(100mA); Output Current: 900mA; Power Supply Rejection Ratio (PRSS): 60dB@(1kHz)
U13 = LP5907MFX-3.3/NOPB: 输出类型:固定;输出极性:正;输出通道数:1;最大输入电压:5.5V;输出电压:3.3V;压差:250mV@(250mA);输出电流:250mA;电源纹波抑制比(PSRR):90dB;; LCSC Part Name: 正 Vin=5.5V Vout=3.3V 250mA 90dB; Supplier Part: C80670; Manufacturer: TI(德州仪器); Supplier Footprint: SOT-23-5; JLCPCB Part Class: Extended Part; Datasheet: https://atta.szlcsc.com/upload/public/pdf/source/20160830/1472551528598.pdf; Supplier: LCSC; Output Type: 固定; Output Polarity: 正; Number of Outputs: 1; Maximum Input Voltage: 5.5V; Output Voltage: 3.3V; Dropout Voltage: 250mV@(250mA); Output Current: 250mA; Power Supply Rejection Ratio (PSRR): 90dB; Power Supply Rejection Ratio (PRSS): 90dB@(100Hz),60dB@(100kHz)
U14 = MT3608: 功能类型:升压型;同步整流:-;输出通道数:1;拓扑结构:升压式;输入电压:2V~24V;输出电压:28V;输出电流(最大值):-;开关频率:1.2MHz;; LCSC Part Name: 升压型 2V~24V 1.2MHz; Supplier Part: C84817; Manufacturer: 西安航天民芯; Supplier Footprint: SOT-23-6; JLCPCB Part Class: 扩展库; Datasheet: https://atta.szlcsc.com/upload/public/pdf/source/20161110/1478743351706.pdf; Supplier: LCSC; Function: 升压型; Number of Outputs: 1; Topology: 升压式; Input Voltage: 2V~24V; Output Voltage: 28V; Switching Frequency: 1.2MHz
C8 C21 C25 C26 C28 C29 = C1206X7R106K500NT: 容值:10uF;精度:±10%;额定电压:50V;材质(温度系数):-;; LCSC Part Name: 10uF ±10% 50V; Supplier Part: C729470; Manufacturer: SANYEAR(叁叶源); Supplier Footprint: 1206; JLCPCB Part Class: Extended Part; Datasheet: https://atta.szlcsc.com/upload/public/pdf/source/20200102/C475251_1E30ECAC0E8AE7254982658A02A2D78C.pdf; Supplier: LCSC; Tolerance: ±10%; Voltage Rated: 50V; Check: true
H1 = MR30-M: Supplier Part: C146690; Supplier: LCSC; Check: true
Q7-Q12 = CJAC100SN08: Supplier: LCSC; Supplier Part: C504077; Manufacturer: CJ; JLCPCB Part Class: Extended Part; Check: true
R2 R3 R14 = FMF25FPHR005-LHL: 阻值:5mΩ;精度:±1%;功率:1W;温度系数:±70ppm/℃;; LCSC Part Name: 5mΩ ±1% 1W; Supplier Part: C105361; Manufacturer: PSA(信昌电陶); Supplier Footprint: 2512; JLCPCB Part Class: Extended Part; Datasheet: https://atta.szlcsc.com/upload/public/pdf/source/20170410/1491788444204.pdf; Supplier: LCSC; Tolerance: ±1%; Power(Watts): 1W; Temperature Coefficient: ±70ppm/℃
R7 R11 R19 R22-R24 = CR0603J2R20P05Z: 阻值:2.2Ω;精度:±5%;功率:100mW;温度系数:±400ppm/℃;; LCSC Part Name: 2.2Ω ±5% 100mW; Supplier Part: C881125; Manufacturer: EVER OHMS(天二科技); Supplier Footprint: 0603; JLCPCB Part Class: Extended Part; Datasheet: https://atta.szlcsc.com/upload/public/pdf/source/20201014/C881429_ABC29D63C8D6A11EB63D87348B25AA7B.pdf; Supplier: LCSC; Tolerance: ±5%; Power(Watts): 100mW; Temperature Coefficient: ±400ppm/℃; Check: true
U1 = FD6288T: 三个独立的半桥栅极驱动集成电路芯片; Supplier Part: C97683; Manufacturer: Fortior Tech(峰岹); Supplier Footprint: TSSOP-20; JLCPCB Part Class: Extended Part; Datasheet: https://atta.szlcsc.com/upload/public/pdf/source/20180912/C97683_ECE58C9DF7F061C95E95DF4276B152DC.pdf; Supplier: LCSC
U4 U8 U9 = INA181A2IDBVT: 运放类型:Current Sense;放大器组数:1;增益带宽积（GBP）:-;压摆率（SR）:2 V/us;各通道供电电流:260μA;; Supplier Part: C116200; Manufacturer: TI(德州仪器); Supplier Footprint: SOT-23-6; JLCPCB Part Class: Extended Part; Datasheet: https://atta.szlcsc.com/upload/public/pdf/source/20180326/C116200_68218766D2BE3223450F49F5A560947F.pdf; Supplier: LCSC; Amplifier Type: Current Sense; Number of Circuits: 1; Slew Rate（SR）: 2 V/us; Iq per channel (Typ): 260μA

## Nets
5V: C5.2 C10.1 C20.2 C31.2 C89.2 CN1.1 D4.1(K) L1.1 L2.2 LED4.4(VDD) R27.1 R28.1 TP2.1 U7.1(VIN) U7.3(CE) U13.1(IN) U13.3(EN) U14.5(IN)
AVCC: C30.2 C32.1 R21.1 U3.9(VDDA) U4.6(VS) U8.6(VS) U9.6(VS) U13.5(OUT)
GND: C1.1 C2.2 C4.1 C5.1 C7.1 C9.1 C10.2 C13.1 C14.1 C17.1 C18.1 C19.1 C20.1 C22.2 C23.2 C24.2 C27.1 C30.1 C31.1 C32.2 C46.1 C89.1 C90.1 CN1.4 CN1.5 CN1.6 CN4.4 CN4.5 CN4.6 CN5.6 CN7.3 CN7.4 LED2.1(K) LED4.2(GND) R8.2 R10.2 R13.2 R15.2 R20.2 R25.2 R26.2 R61.2 SW1.1 TP3.1 U1.8(COM) U2.2(GND) U3.8(VSSA) U3.23(VSS_1) U3.35(VSS_2) U3.47(VSS_3) U4.2(GND) U6.2(GND) U6.8(RS) U6.9(EP) U7.2(VSS) U8.2(GND) U9.2(GND) U13.2(GND) U14.2(GND) USBC1.0 USBC1.A1(GND) USBC1.A12(GND) USBC1.B1(GND) USBC1.B12(GND) X1.2(GND)
PGND: C8.1 C21.1 C25.1 C26.1 C28.1 C29.1 D1.2(A) MC1.1 MC2.1 MC3.1 MC4.1 MC5.1 MC6.1 R2.1 R3.1 R14.1 R61.1 U4.3(IN+) U8.3(IN+) U9.3(IN+)
VCC: C1.2 C14.2 C17.2 C18.2 C19.2 C90.2 CN4.1 CN5.1 CN6.1 R4.1 R6.1 RT1.2 SW2.2 TP1.1 U3.1(VBAT) U3.24(VDD_1) U3.36(VDD_2) U3.48(VDD_3) U6.3(VCC) U7.5(VOUT) X1.4(VDD)
_USB_DM: R63.2 USBC1.A7(DN1) USBC1.B7(DN2)
_USB_DP: R62.2 USBC1.A6(DP1) USBC1.B6(DP2)
BOOT0: R10.1 SW2.1 U3.44(BOOT0)
CAN_H: CN7.2 R9.1 U6.7(CANH)
CAN_L: CN7.1 R9.2 U6.6(CANL)
CAN_RX: U3.41(PB5) U6.4(R)
CAN_TX: U3.42(PB6) U6.1(D)
CUR_A: R18.2 U4.1(OUT)
CUR_B: R17.2 U8.1(OUT)
CUR_C: R16.2 U9.1(OUT)
DCBUS: C8.2 C21.2 C25.2 C26.2 C27.2 C28.2 C29.2 D1.1(K) MC1.2 MC2.2 MC3.2 MC4.2 MC5.2 MC6.2 Q7.5(D) Q7.6(D) Q7.7(D) Q7.8(D) Q8.5(D) Q8.6(D) Q8.7(D) Q8.8(D) Q9.5(D) Q9.6(D) Q9.7(D) Q9.8(D) R1.1 R29.1 U2.5(VIN)
M0_GH_A: R7.1 U1.13(HO3)
M0_GH_B: R19.1 U1.16(HO2)
M0_GH_C: R23.1 U1.19(HO1)
M0_GL_A: R11.1 U1.9(LO3)
M0_GL_B: R22.1 U1.10(LO2)
M0_GL_C: R24.1 U1.11(LO1)
M0_SH_A: C3.1 H1.3(1) Q7.1(S) Q7.2(S) Q7.3(S) Q10.5(D) Q10.6(D) Q10.7(D) Q10.8(D) U1.12(VS3)
M0_SH_B: C12.1 H1.2 Q8.1(S) Q8.2(S) Q8.3(S) Q11.5(D) Q11.6(D) Q11.7(D) Q11.8(D) U1.15(VS2)
M0_SH_C: C11.1 H1.1(3) Q9.1(S) Q9.2(S) Q9.3(S) Q12.5(D) Q12.6(D) Q12.7(D) Q12.8(D) U1.18(VS1)
M0_SN_A: Q10.1(S) Q10.2(S) Q10.3(S) R14.2 U4.4(IN-)
M0_SN_B: Q11.1(S) Q11.2(S) Q11.3(S) R3.2 U8.4(IN-)
M0_SN_C: Q12.1(S) Q12.2(S) Q12.3(S) R2.2 U9.4(IN-)
M0_VB_A: C3.2 D5.1(C) U1.14(VB3)
M0_VB_B: C12.2 D2.1(C) U1.17(VB2)
M0_VB_C: C11.2 D3.1(C) U1.20(VB1)
NRST: C13.2 R4.2 SW1.2 U3.7(NRST)
PWMA_H: U1.3(HIN3) U3.29(PA8)
PWMA_L: U1.6(LIN3) U3.26(PB13)
PWMB_H: U1.2(HIN2) U3.30(PA9)
PWMB_L: U1.5(LIN2) U3.27(PB14)
PWMC_H: U1.1(HIN1) U3.31(PA10)
PWMC_L: U1.4(LIN1) U3.28(PB15)
REF: R20.1 R21.2 U4.5(REF) U8.5(REF) U9.5(REF)
RGB: LED4.3(DI) U3.10(PA0/WKUP)
SPI1_CS_1: CN5.5 U3.4(PC15/OSC32_OUT)
SPI1_CS_2: TP4.1 U3.20(PB2)
SPI1_MISO: CN5.3 U3.16(PA6)
SPI1_MOSI: CN5.2 U3.17(PA7)
SPI1_SCK: CN5.4 U3.15(PA5)
SWCLK: CN4.3 U3.37(PA14)
SWDIO: CN4.2 U3.34(PA13)
TEMP_1: C7.2 CN6.2 R15.1 U3.11(PA1)
TEMP_2: C46.2 R13.1 RT1.1 U3.12(PA2)
USART_RX: CN1.3 U3.22(PB11)
USART_TX: CN1.2 U3.21(PB10)
USB_DM: R63.1 U3.32(PA11)
USB_DP: R62.1 U3.33(PA12)
V_BUS: C9.2 R1.2 R8.1 U3.19(PB1)
VGS: C2.1 C4.2 D2.2(A) D3.2(A) D5.2(A) D6.1(C) R5.1 U1.7(VCC)
VUSB: D4.2(A) USBC1.A4(VBUS) USBC1.A9(VBUS) USBC1.B4(VBUS) USBC1.B9(VBUS)
$1N231: R29.2 U2.4(EN)
$1N238: C6.2 U2.1(BST)
$1N239: C6.1 L2.1 U2.6(SW)
$1N272: R26.1 R27.2 U2.3(FB)
$1N12003: R28.2 U14.4(EN)
$1N12230: R5.2 R25.1 U14.3(FB)
$1N13637: D6.2(A) L1.2 U14.1(SW)
$2N159: Q9.4(G) R23.2
$2N163: Q8.4(G) R19.2
$2N174: Q10.4(G) R11.2
$2N581: Q7.4(G) R7.2
$2N584: Q11.4(G) R22.2
$2N587: Q12.4(G) R24.2
$3N234: LED2.2(A) R6.2
$3N656: R12.1 U3.5(PD0/OSC_IN)
$3N705: C24.1 R18.1 U3.18(PB0)
$3N730: C23.1 R17.1 U3.14(PA4)
$3N771: C22.1 R16.1 U3.13(PA3)
$3N953: R12.2 X1.3(OUT)

Not connected (* = marked no-connect by the designer): CN5 0*; CN6 3* 4*; LED4 1(DO)*; U3 2(PC13/TAMPER-RTC)* 3(PC14/OSC32_IN)* 6(PD1/OSC_OUT)* 25(PB12)* 38(PA15)* 39(PB3)* 40(PB4)* 43(PB7)* 45(PB8)* 46(PB9)*; U6 5(SHDN)*; U7 4(NC)*; U13 4(NC)*; U14 6(NC)*; USBC1 A5(CC1)* A8(SBU1)* B5(CC2)* B8(SBU2)*; X1 1(OE#)*

## Notes on the sheets
sheet 1
- MC9
sheet 2
- 采样最大电流计算公式：
- 0.005的采样电阻，INA181A2 50倍放大
- 1.35V/0.005/50=5.4A
sheet 3
- CN2
- CAN收发器
- 指示灯
- 复位电路
- 此元件为NTC
- 此元件为NTC
